# Altium schematic sheet power.SchDoc
size A4; SheetNumber: 2; SheetTotal: 5
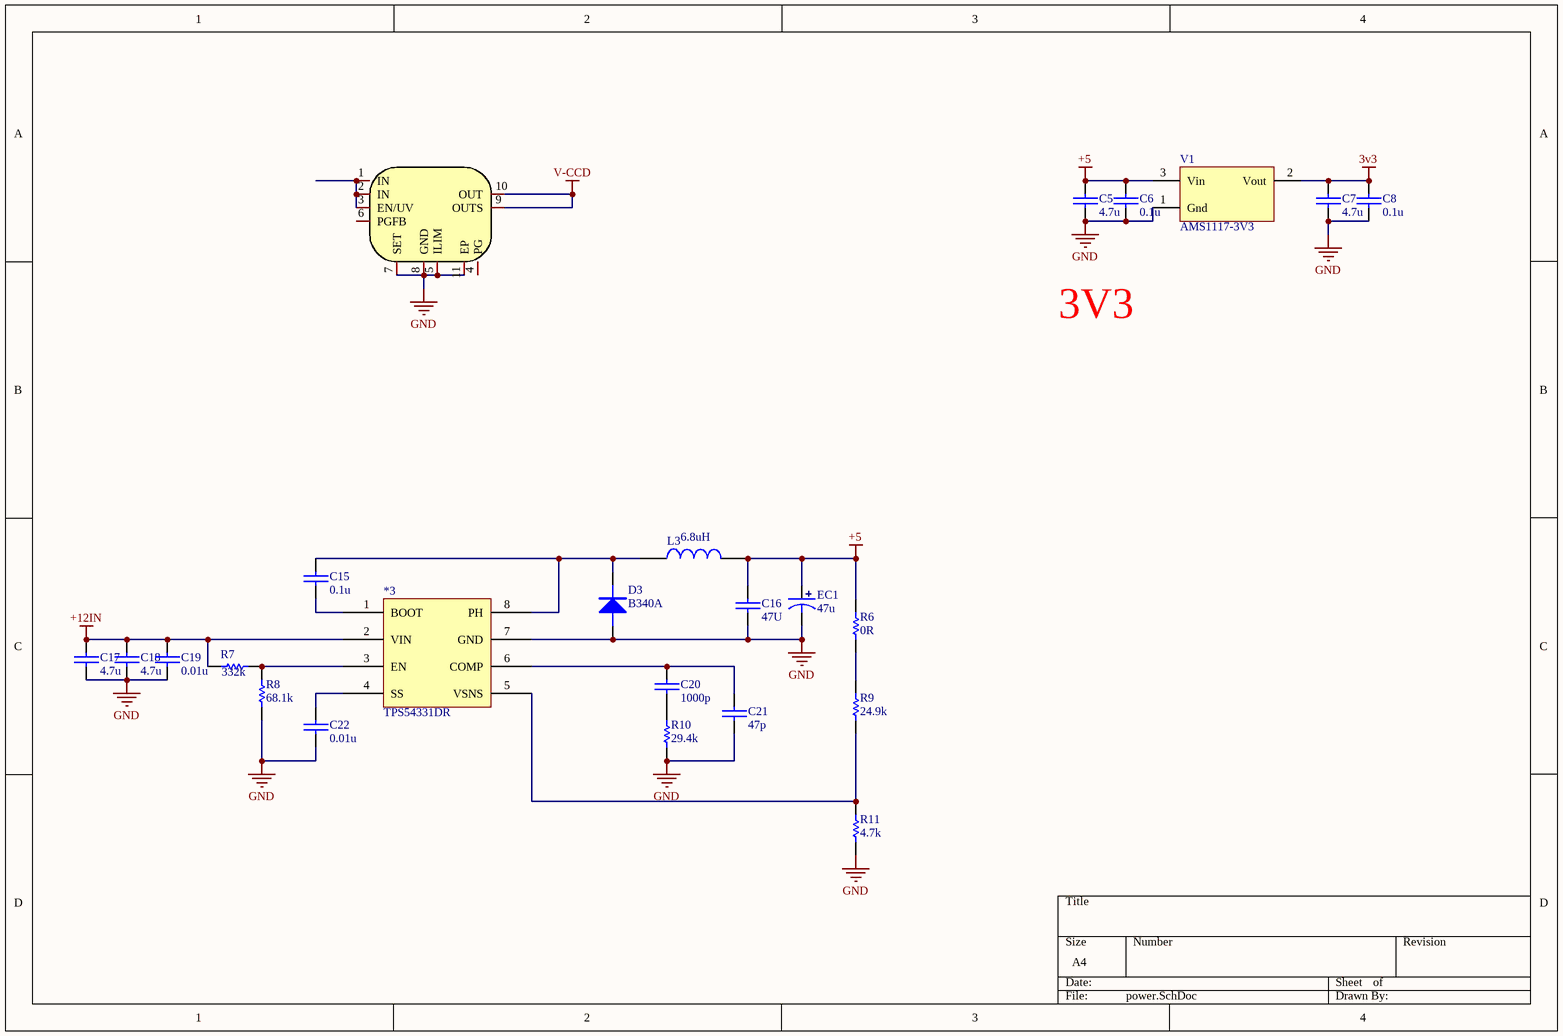
[diagram p0: power.SchDoc]

## Parts
*3  TPS54331DR  [SOIC-8]
C5  4.7u  [0603C]
C6  0.1u  [0603C]
C7  4.7u  [0603C]
C8  0.1u  [0603C]
C15  0.1u  [0603C]
C16  47U  [0603C]
C17  4.7u  [0603C]
C18  4.7u  [0603C]
C19  0.01u  [0603C]
C20  1000p  [0603C]
C21  47p  [0603C]
C22  0.01u  [0603C]
D3  B340A  [SMA/DO-214AC]
EC1  47u  [SMD-EC6.3X6.3X10]
L3  6.8uH  [L-SMD-0630]
R6  0R  [0603R]
R7  332k  [0603R]
R8  68.1k  [0603R]
R9  24.9k  [0603R]
R10  29.4k  [0603R]
R11  4.7k  [0603R]
U??  LT3045EDD#PBF  [DFN-10_L3.0-W3.0-P0.50-BL-EP]  (value not drawn)
V1  AMS1117-3V3  [SOT223_L]

## Nets
3v3: C7.2 C8.2 V1.2(Vout)
+5: C5.2 C6.2 C16.2 EC1.1 L3.2 R6.2 V1.3(Vin)
+12IN: *3.2(VIN) C17.2 C18.2 C19.2 R7.2
GND: *3.7(GND) C5.1 C6.1 C7.1 C8.1 C16.1 C17.1 C18.1 C19.1 C21.1 C22.1 D3.A EC1.2 R8.1 R10.1 R11.1 U??.5(ILIM) U??.7(SET) U??.8(GND) U??.11(EP) V1.1(Gnd)
V-CCD: U??.9(OUTS) U??.10(OUT)
Net*3_1: *3.1(BOOT) C15.1
Net*3_3: *3.3(EN) R7.1 R8.2
Net*3_4: *3.4(SS) C22.2
Net*3_5: *3.5(VSNS) R9.1 R11.2
Net*3_6: *3.6(COMP) C20.2 C21.2
Net*3_8: *3.8(PH) C15.2 D3.K L3.1
NetC20_1: C20.1 R10.2
NetR6_1: R6.1 R9.2
NetU??_1: U??.1(IN) U??.2(IN) U??.3(EN/UV)

Not connected (* = marked no-connect by the designer): U?? 4(PG) 6(PGFB)

## Notes on the sheet
- 3V3

## Library data of the parts
*3 = TPS54331DR: 降压型DC-DC
C5-C8 C15-C22 = CAP: 无极性电容
D3 = DIODE: 普通二极管
EC1 = ECAP: 贴片电解电容
L3 = L: INDUCTOR
R6-R11 = RES: 电阻
U?? = LT3045EDD#PBF: 超低噪声正极性ldo，1.8-20v，500ma; Manufacturer: ADI(亚德诺)/LINEAR(凌特); Symbol: LT3045EDD#PBF_C666574; Add into BOM: yes; Name: LT3045EDD#PBF; Device: LT3045EDD#PBF; LCSC Part Name: LT3045EDD#PBF; Supplier Part: C666574; Manufacturer Part: LT3045EDD#PBF; Supplier Footprint: DFN-10-EP(3x3); JLCPCB Part Class: Extended Part; Datasheet: https://atta.szlcsc.com/upload/public/pdf/source/20200416/C514420_E440C492D6C74EAE6AB301243586F696.pdf; Supplier: LCSC; Convert to PCB: yes; Output Type: -
V1 = AMS1117: LDO; BOM名称: 稳压芯片; 封装库来自淘宝卖家：黄晶宝石: 其他店铺购入的买家，请立即申请退款，本店现金奖励200~1000元